# Altium schematic sheet RS422.SchDoc
size A4; SheetNumber: 7; SheetTotal: 15
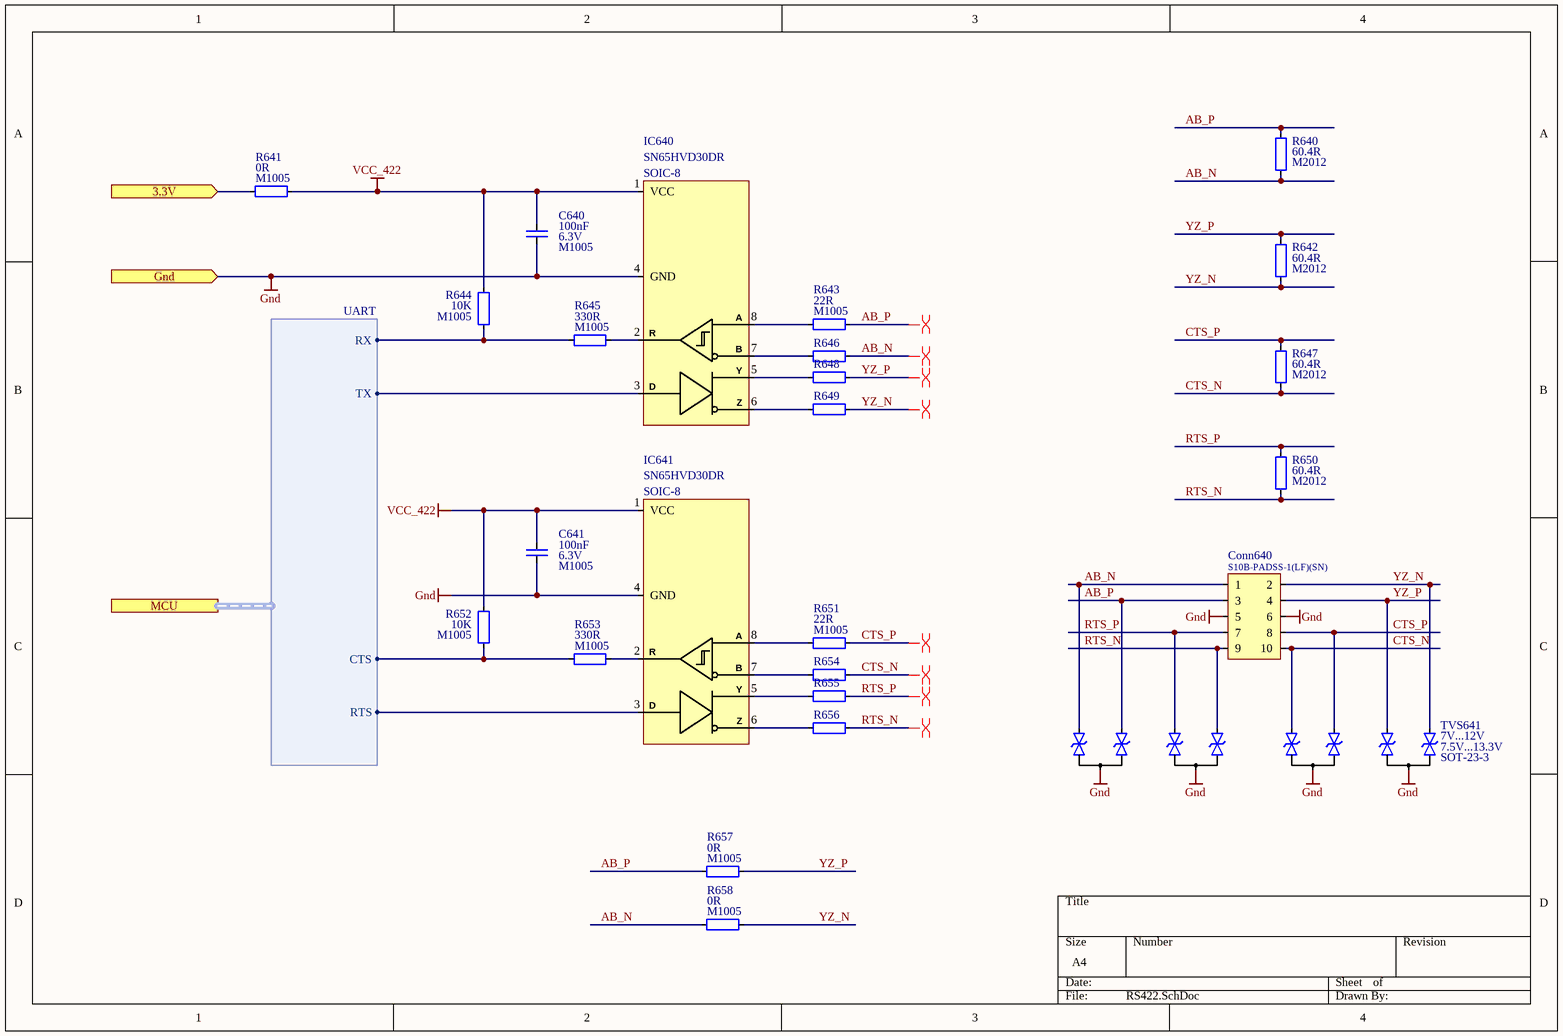
[diagram p0: RS422.SchDoc]

## Parts
C640  value 100nF  Voltage: 6.3V  Package: M1005  [Capacitor_Ceramic_M1005_I0402]  (hidden comment: Capacitor_Ceramic)
C641  value 100nF  Voltage: 6.3V  Package: M1005  [Capacitor_Ceramic_M1005_I0402]  (hidden comment: Capacitor_Ceramic)
Conn640  Manufacturer Part Number: S10B-PADSS-1(LF)(SN)  [Connector, S10B-PADSS-1]  (hidden comment: Connector - 10P)
IC640  Manufacturer Part Number: SN65HVD30DR  Package: SOIC-8  [SOIC-8, NB]  (hidden comment: RS422 - Texas, SN65HVD30D)
IC641  Manufacturer Part Number: SN65HVD30DR  Package: SOIC-8  [SOIC-8, NB]  (hidden comment: RS422 - Texas, SN65HVD30D)
R640  value 60.4R  Package: M2012  [Resistor_Smd_M2012_I0805]  (hidden comment: Resistor)
R641  value 0R  Package: M1005  [Resistor_Smd_M1005_I0402]  (hidden comment: Resistor)
R642  value 60.4R  Package: M2012  [Resistor_Smd_M2012_I0805]  (hidden comment: Resistor)
R643  value 22R  Package: M1005  [Resistor_Smd_M1005_I0402]  (hidden comment: Resistor)
R644  value 10K  Package: M1005  [Resistor_Smd_M1005_I0402]  (hidden comment: Resistor)
R645  value 330R  Package: M1005  [Resistor_Smd_M1005_I0402]  (hidden comment: Resistor)
R646  Resistor  [Resistor_Smd_M1005_I0402]  (value not drawn)
R647  value 60.4R  Package: M2012  [Resistor_Smd_M2012_I0805]  (hidden comment: Resistor)
R648  Resistor  [Resistor_Smd_M1005_I0402]  (value not drawn)
R649  Resistor  [Resistor_Smd_M1005_I0402]  (value not drawn)
R650  value 60.4R  Package: M2012  [Resistor_Smd_M2012_I0805]  (hidden comment: Resistor)
R651  value 22R  Package: M1005  [Resistor_Smd_M1005_I0402]  (hidden comment: Resistor)
R652  value 10K  Package: M1005  [Resistor_Smd_M1005_I0402]  (hidden comment: Resistor)
R653  value 330R  Package: M1005  [Resistor_Smd_M1005_I0402]  (hidden comment: Resistor)
R654  Resistor  [Resistor_Smd_M1005_I0402]  (value not drawn)
R655  Resistor  [Resistor_Smd_M1005_I0402]  (value not drawn)
R656  Resistor  [Resistor_Smd_M1005_I0402]  (value not drawn)
R657  value 0R  Package: M1005  [Resistor_Smd_M1005_I0402]  (hidden comment: Resistor)
R658  value 0R  Package: M1005  [Resistor_Smd_M1005_I0402]  (hidden comment: Resistor)
TVS640  Diode_Tvs_2P_Bidirectional  [Diode_SOT-23-3_2P_Bidirectional_Type_1]  (value not drawn)
TVS641  Voltage, Break Down: 7.5V...13.3V  Voltage, Stand Off: 7V...12V  Package: SOT-23-3  [Diode_SOT-23-3_2P_Bidirectional_Type_1]  (hidden comment: Diode_Tvs_2P_Bidirectional)
TVS642  Diode_Tvs_2P_Bidirectional  [Diode_SOT-23-3_2P_Bidirectional_Type_1]  (value not drawn)
TVS643  Diode_Tvs_2P_Bidirectional  [Diode_SOT-23-3_2P_Bidirectional_Type_1]  (value not drawn)

## Ports
3.3V (in), Gnd (in), MCU (harness UART)

## Harnesses
UART: RX, TX, RTS, CTS

## Nets
Gnd: C640.2 C641.2 Conn640.5 Conn640.6 IC640.4(GND) IC641.4(GND) TVS640.Common TVS641.Common TVS642.Common TVS643.Common ; port Gnd
VCC_422: C640.1 C641.1 IC640.1(VCC) IC641.1(VCC) R641.2 R644.2 R652.2
3.3V: R641.1 ; port 3.3V
AB_N: Conn640.1 R640.2 R646.2 R658.1 TVS642.D1
AB_P: Conn640.3 R640.1 R643.2 R657.1 TVS642.D2
CTS_N: Conn640.10 R647.2 R654.2 TVS643.D1
CTS_P: Conn640.8 R647.1 R651.2 TVS643.D2
RTS_N: Conn640.9 R650.2 R656.2 TVS640.D2
RTS_P: Conn640.7 R650.1 R655.2 TVS640.D1
YZ_N: Conn640.2 R642.2 R649.2 R658.2 TVS641.D2
YZ_P: Conn640.4 R642.1 R648.2 R657.2 TVS641.D1
NetIC640_2: IC640.2(R) R645.2
NetIC640_3: IC640.3(D) ; port MCU.TX
NetIC640_5: IC640.5(Y) R648.1
NetIC640_6: IC640.6(Z) R649.1
NetIC640_7: IC640.7(B) R646.1
NetIC640_8: IC640.8(A) R643.1
NetIC641_2: IC641.2(R) R653.2
NetIC641_3: IC641.3(D) ; port MCU.RTS
NetIC641_5: IC641.5(Y) R655.1
NetIC641_6: IC641.6(Z) R656.1
NetIC641_7: IC641.7(B) R654.1
NetIC641_8: IC641.8(A) R651.1
NetR644_1: R644.1 R645.1 ; port MCU.RX
NetR652_1: R652.1 R653.1 ; port MCU.CTS

## Layout directives
differential pair; differential pair class Rs422_120: AB_N, AB_P, CTS_N, CTS_P, RTS_N, RTS_P, YZ_N, YZ_P

## Library data of the parts
C640 C641 = Capacitor_Ceramic: Cap, Cer, 100nF, 6.3V, M1005; Manufacturer Part Number: 04026D104KAT4A; Manufacturer: Kyocera; Temperature Coefficient: X5R; Tolerance: 10%; ComponentLink1Description: Datasheet; ComponentLink1URL: E:\Altium\Datasheets\Capacitor\Kyocera - X5R.pdf; ComponentLink2Description: Supplier Link; ComponentLink2URL: https://www.digikey.com/en/products/detail/kyocera-avx/04026D104KAT4A/8107673; Supplier: Digikey; Supplier Part Number: 478-11504-1-ND; Operating Temperature, Min: +85℃; Operating Temperature, Max: -55℃; Quantity, Min: 1; Quantity, Max: 250000; Price, Min: 0.1; Supplier Currency: $; Price, Max: 0.00189; Supplier Link: https://www.digikey.com/en/products/detail/kyocera-avx/04026D104KAT4A/8107673; Component Type: Ceramic; Component Category: Capacitor
Conn640 = Connector - 10P: Conn, JST, 10P, TH, PAD, Side Entry; ComponentLink1Description: Datasheet; ComponentLink1URL: E:\Altium\Datasheets\Connector - JST\PAD Family.pdf; ComponentLink2Description: Supplier Link; ComponentLink2URL: https://www.digikey.com/en/products/detail/jst-sales-america-inc/S10B-PADSS-1-LF-SN/1634773; Supplier: Digikey; Supplier Part Number: 455-2032-ND; Manufacturer: JST; Operating Temperature, Min: -25℃; Operating Temperature, Max: +85℃; Quantity, Min: 1; Quantity, Max: 10080; Price, Min: 0.65; Supplier Currency: $; Price, Max: 0.27565; Supplier Link: https://www.digikey.com/en/products/detail/jst-sales-america-inc/S10B-PADSS-1-LF-SN/1634773; Component Type: PCB; Component Category: Connector; Package: TH, 2 Rows, RA, Side Entry
IC640 IC641 = RS422 - Texas, SN65HVD30D: IC, Interface, RS422, SOIC-8; ComponentLink1Description: Datasheet; ComponentLink1URL: E:\Altium\Datasheets\IC - Interface\RS422 - Texas, SN65HVD3x.pdf; ComponentLink2Description: Supplier Link; Supplier: Digikey; Supplier Part Number: 296-19625-1-ND; Manufacturer: Texas; Operating Temperature, Min: -55℃; Operating Temperature, Max: +85℃; Quantity, Min: 1; Quantity, Max: 2500; Price, Min: 4.32; Supplier Currency: $; Price, Max: 2.16943; Supplier Link: https://www.digikey.com/en/products/detail/texas-instruments/SN65HVD30DR/1016459; Component Type: Interface; Component Category: IC
  IC640: ComponentLink2URL: https://www.digikey.com/en/products/detail/texas-instruments/SN65HVD30DR/1016459
  IC641: ComponentLink2URL: https://www.digikey.com/en/products/detail/texas-instruments/SN65HVD30D/1574539
R640 R642 R647 R650 = Resistor: Res, 60.4R, 1%, M1005; Manufacturer: Yageo; Manufacturer Part Number: RC0805FR-0760R4L; Component Category: Resistor; Component Type: Fixed Value; Tolerance: 1%; Supplier Link: https://www.digikey.com/en/products/detail/yageo/RC0805FR-0760R4L/728073; Supplier Currency: $; Price, Max: 0.00328; Price, Min: 0.1; Quantity, Max: 125000; Quantity, Min: 1; Operating Temperature, Max: -55℃; Operating Temperature, Min: +155℃; Supplier Part Number: 311-60.4CRCT-ND; Supplier: Digikey; ComponentLink1Description: Datasheet; ComponentLink1URL: E:\Altium\Datasheets\Resistor\Yageo - RC_L Series.pdf; ComponentLink2Description: Supplier Link; ComponentLink2URL: https://www.digikey.com/en/products/detail/yageo/RC0805FR-0760R4L/728073
R641 R657 R658 = Resistor: Res, 0R, M1005; Manufacturer: Yageo; Manufacturer Part Number: RC0402FR-070RL; Component Category: Resistor; Component Type: Fixed Value; Tolerance: *; Supplier Link: https://www.digikey.com/en/products/detail/yageo/RC0402FR-070RL/2827570; Supplier Currency: $; Price, Max: 0.00109; Price, Min: 0.1; Quantity, Max: 50000; Quantity, Min: 1; Operating Temperature, Max: -55℃; Operating Temperature, Min: +155℃; Supplier Part Number: 311-0.0LRCT-ND; Supplier: Digikey; ComponentLink1Description: Datasheet; ComponentLink1URL: E:\Altium\Datasheets\Resistor\Yageo - RC_L Series.pdf; ComponentLink2Description: Supplier Link; ComponentLink2URL: https://www.digikey.com/en/products/detail/yageo/RC0402FR-070RL/2827570
R643 R646 R648 R649 R651 R654-R656 = Resistor: Res, 22R, 1%, M1005; Manufacturer: Yageo; Manufacturer Part Number: RC0402FR-0722RL; Component Category: Resistor; Component Type: Fixed Value; Tolerance: 1%; Supplier Link: https://www.digikey.com/en/products/detail/yageo/RC0402FR-0722RL/726562; Supplier Currency: $; Price, Max: 0.00129; Price, Min: 0.1; Quantity, Max: 100000; Quantity, Min: 1; Operating Temperature, Max: -55℃; Operating Temperature, Min: +155℃; Supplier Part Number: 311-22.0LRCT-ND; Supplier: Digikey; ComponentLink1Description: Datasheet; ComponentLink1URL: E:\Altium\Datasheets\Resistor\Yageo - RC_L Series.pdf; ComponentLink2Description: Supplier Link; ComponentLink2URL: https://www.digikey.com/en/products/detail/yageo/RC0402FR-0722RL/726562
  R646 R648 R649 R654-R656: Value: 22R; Package: M1005
R644 R652 = Resistor: Res, 10K, 1%, M1005; Manufacturer: Yageo; Manufacturer Part Number: RC0402FR-0710KP; Component Category: Resistor; Component Type: Fixed Value; Tolerance: 1%; Supplier Link: https://www.digikey.com/en/products/detail/yageo/RC0402FR-0710KP/4935264; Supplier Currency: $; Price, Max: 0.00282; Price, Min: 0.1; Quantity, Max: 100000; Quantity, Min: 1; Operating Temperature, Max: -55℃; Operating Temperature, Min: +155℃; Supplier Part Number: YAG1249CT-ND; Supplier: Digikey; ComponentLink1Description: Datasheet; ComponentLink1URL: E:\Altium\Datasheets\Resistor\Yageo - RC_L Series.pdf; ComponentLink2Description: Supplier Link; ComponentLink2URL: https://www.digikey.com/en/products/detail/yageo/RC0402FR-0710KP/4935264
R645 R653 = Resistor: Res, 330R, 1%, M1005; Manufacturer: Yageo; Manufacturer Part Number: RC0402FR-07330RL; Component Category: Resistor; Component Type: Fixed Value; Tolerance: 1%; Supplier Link: https://www.digikey.com/en/products/detail/yageo/RC0402FR-07330RL/726594; Supplier Currency: $; Price, Max: 0.00129; Price, Min: 0.1; Quantity, Max: 100000; Quantity, Min: 1; Operating Temperature, Max: -55℃; Operating Temperature, Min: +155℃; Supplier Part Number: 311-330LRCT-ND; Supplier: Digikey; ComponentLink1Description: Datasheet; ComponentLink1URL: E:\Altium\Datasheets\Resistor\Yageo - RC_L Series.pdf; ComponentLink2Description: Supplier Link; ComponentLink2URL: https://www.digikey.com/en/products/detail/yageo/RC0402FR-07330RL/726594
TVS640 TVS642 TVS643 = Diode_Tvs_2P_Bidirectional: TVS, 2P, Bidirectional, 7V/12V, SOT-23-3; Manufacturer Part Number: CDSOT23-SM712; Manufacturer: Bourns; Component Category: Diode; Voltage, Break Down: 7.5V...13.3V; Voltage, Stand Off: 7V...12V; ComponentLink1Description: Datasheet; ComponentLink1URL: E:\Altium\Datasheets\Diode\Bourns, CDSOT23-SM712.pdf; ComponentLink2Description: Supplier Link; ComponentLink2URL: https://www.digikey.com/en/products/detail/bourns-inc/CDSOT23-SM712/1630592; Supplier: Digikey; Supplier Part Number: CDSOT23-SM712CT-ND; Operating Temperature, Min: -55℃; Operating Temperature, Max: +150℃; Quantity, Min: 1; Quantity, Max: 3000; Price, Min: 1.59; Price, Max: 0.675; Supplier Currency: $; Supplier Link: https://www.digikey.com/en/products/detail/bourns-inc/CDSOT23-SM712/1630592; Component Type: TVS; Package: SOT-23-3
TVS641 = Diode_Tvs_2P_Bidirectional: TVS, 2P, Bidirectional, 7V/12V, SOT-23-3; Manufacturer Part Number: CDSOT23-SM712; Manufacturer: Bourns; Component Category: Diode; ComponentLink1Description: Datasheet; ComponentLink1URL: E:\Altium\Datasheets\Diode\Bourns, CDSOT23-SM712.pdf; ComponentLink2Description: Supplier Link; ComponentLink2URL: https://www.digikey.com/en/products/detail/bourns-inc/CDSOT23-SM712/1630592; Supplier: Digikey; Supplier Part Number: CDSOT23-SM712CT-ND; Operating Temperature, Min: -55℃; Operating Temperature, Max: +150℃; Quantity, Min: 1; Quantity, Max: 3000; Price, Min: 1.59; Price, Max: 0.675; Supplier Currency: $; Supplier Link: https://www.digikey.com/en/products/detail/bourns-inc/CDSOT23-SM712/1630592; Component Type: TVS